# Altium project 蓝牙门禁.PrjPCB
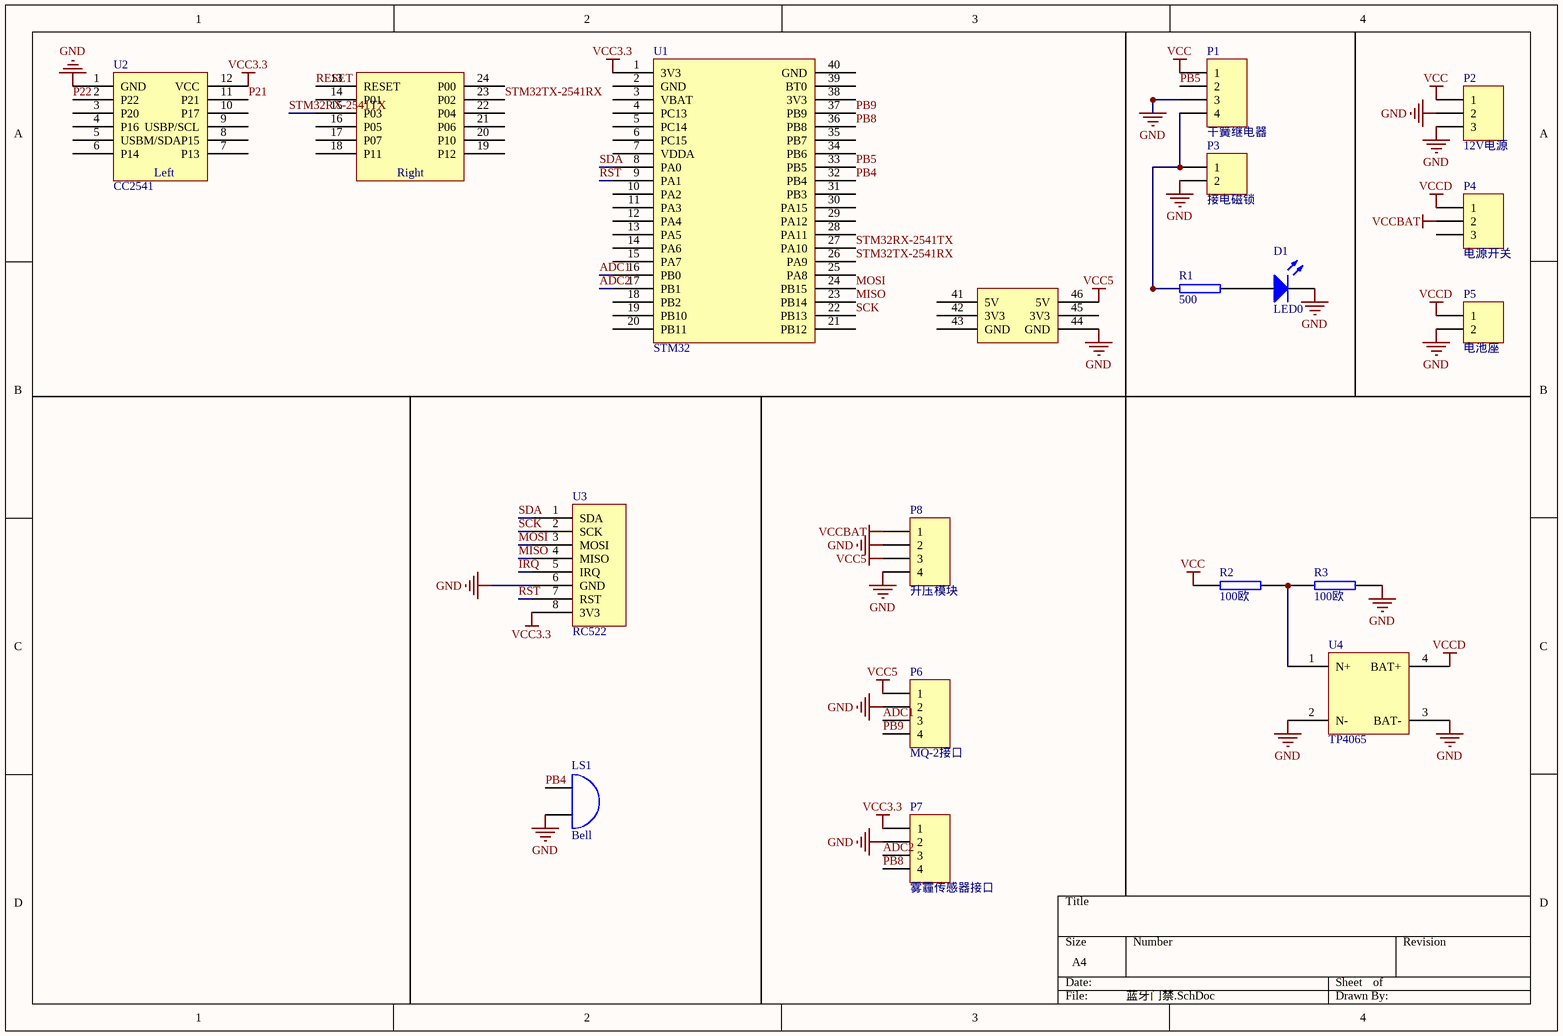
[diagram p0: 蓝牙门禁.SchDoc]
1 sheet, 17 parts. Net scope: global (net labels, ports and power ports of the same name join across sheets).
Board file: 蓝牙门禁PCB.PcbDoc

## Sheet 蓝牙门禁.SchDoc
size A4

### Parts
D1  LED0  [0805-led]
LS1  Bell  [BUZZER-12MM]
P1  干簧继电器  [干簧继电器SIP-1A05]
P2  12V电源  [DC-005(5.5MM)]
P3  接电磁锁  [接线端子-0.5]
P4  电源开关  [拨动开关（2mm）]
P5  电池座  [7号电池盒-4.5CM]
P6  MQ-2接口  [HDR1X4]
P7  雾霾传感器接口  [HDR1X4]
P8  升压模块  [DC-DC升压模块]
R1  500  [0805-SMALL]
R2  100欧  [0805-SMALL]
R3  100欧  [0805-SMALL]
U1  STM32  [STM32_Smart]
U2  CC2541  [Smart_RF_2541]
U3  RC522  [HDR1X8]
U4  TP4065  [TP4065_模块]

### Nets
GND: D1.2(K) LS1.2(B) P1.3 P2.2 P2.3 P3.2 P5.2 P6.2 P7.2 P8.2 P8.4 R3.2 U1.44(GND) U2.1(GND) U3.6(GND) U4.2(N-) U4.3(BAT-)
VCC: P1.1 P2.1 R2.1
VCC3.3: P7.1 U1.1(3V3) U2.12(VCC) U3.8(3V3)
VCC5: P6.1 P8.3 U1.46(5V)
VCCBAT: P4.2 P8.1
VCCD: P4.1 P5.1 U4.4(BAT+)
ADC1: P6.3 U1.16(PB0)
ADC2: P7.3 U1.17(PB1)
IRQ: U3.5(IRQ)
MISO: U1.23(PB14) U3.4(MISO)
MOSI: U1.24(PB15) U3.3(MOSI)
P21: U2.11(P21)
P22: U2.2(P22)
PB4: LS1.1(A) U1.32(PB4)
PB5: P1.2 U1.33(PB5)
PB8: P7.4 U1.36(PB8)
PB9: P6.4 U1.37(PB9)
RESET: U2.13(RESET)
RST: U1.9(PA1) U3.7(RST)
SCK: U1.22(PB13) U3.2(SCK)
SDA: U1.8(PA0) U3.1(SDA)
STM32RX-2541TX: U1.27(PA10) U2.15(P03)
STM32TX-2541RX: U1.26(PA9) U2.23(P02)
NetD1_1: D1.1(A) R1.2
NetP1_4: P1.4 P3.1 R1.1
NetR2_2: R2.2 R3.1 U4.1(N+)

Not connected (* = marked no-connect by the designer): P4 3; U1 2(GND) 3(VBAT) 4(PC13) 5(PC14) 6(PC15) 7(VDDA) 10(PA2) 11(PA3) 12(PA4) 13(PA5) 14(PA6) 15(PA7) 18(PB2) 19(PB10) 20(PB11) 21(PB12) 25(PA8) 28(PA11) 29(PA12) 30(PA15) 31(PB3) 34(PB6) 35(PB7) 38(3V3) 39(BT0) 40(GND) 41(5V) 42(3V3) 43(GND) 45(3V3); U2 3(P20) 4(P16) 5(USBM/SDA) 6(P14) 7(P13) 8(P15) 9(USBP/SCL) 10(P17) 14(P01) 16(P05) 17(P07) 18(P11) 19(P12) 20(P10) 21(P06) 22(P04) 24(P00)

### Notes on the sheet
- (in symbol Smart_RF_2541) Left; Right

### Library data of the parts
D1 = LED0: Typical INFRARED GaAs LED; Published: 8-Jun-2000; LatestRevisionDate: 08-Jul-2005; LatestRevisionNote: Mech Layer 1 removed.; PackageReference: LED-0; Publisher: Altium Limited; PackageDescription: LED; 2 Leads
LS1 = Bell: Electrical Bell; Published: 24-Mar-1999; LatestRevisionDate: 17-Jul-2002; LatestRevisionNote: Re-released for DXP Platform.; PackageReference: PIN2; Publisher: Altium Limited
P1 P6-P8 = Header 4: Header, 4-Pin; LatestRevisionDate: 17-Jul-2002; LatestRevisionNote: Re-released for DXP Platform.; Publisher: Altium Limited
P2 P4 = Header 3: Header, 3-Pin; LatestRevisionDate: 17-Jul-2002; LatestRevisionNote: Re-released for DXP Platform.; Publisher: Altium Limited
P3 = Header 2H: Header, 2-Pin, Right Angle; LatestRevisionDate: 17-Jul-2002; LatestRevisionNote: Re-released for DXP Platform.; Publisher: Altium Limited
P5 = Header 2: Header, 2-Pin; LatestRevisionDate: 17-Jul-2002; LatestRevisionNote: Re-released for DXP Platform.; Publisher: Altium Limited
R1-R3 = RES2
U1 = STM32_Smart
U2 = Smart_RF_2541
U3 = RFID_RC522
U4 = TP4056_ 模块